# Altium project GYT_Rx.PrjPcb
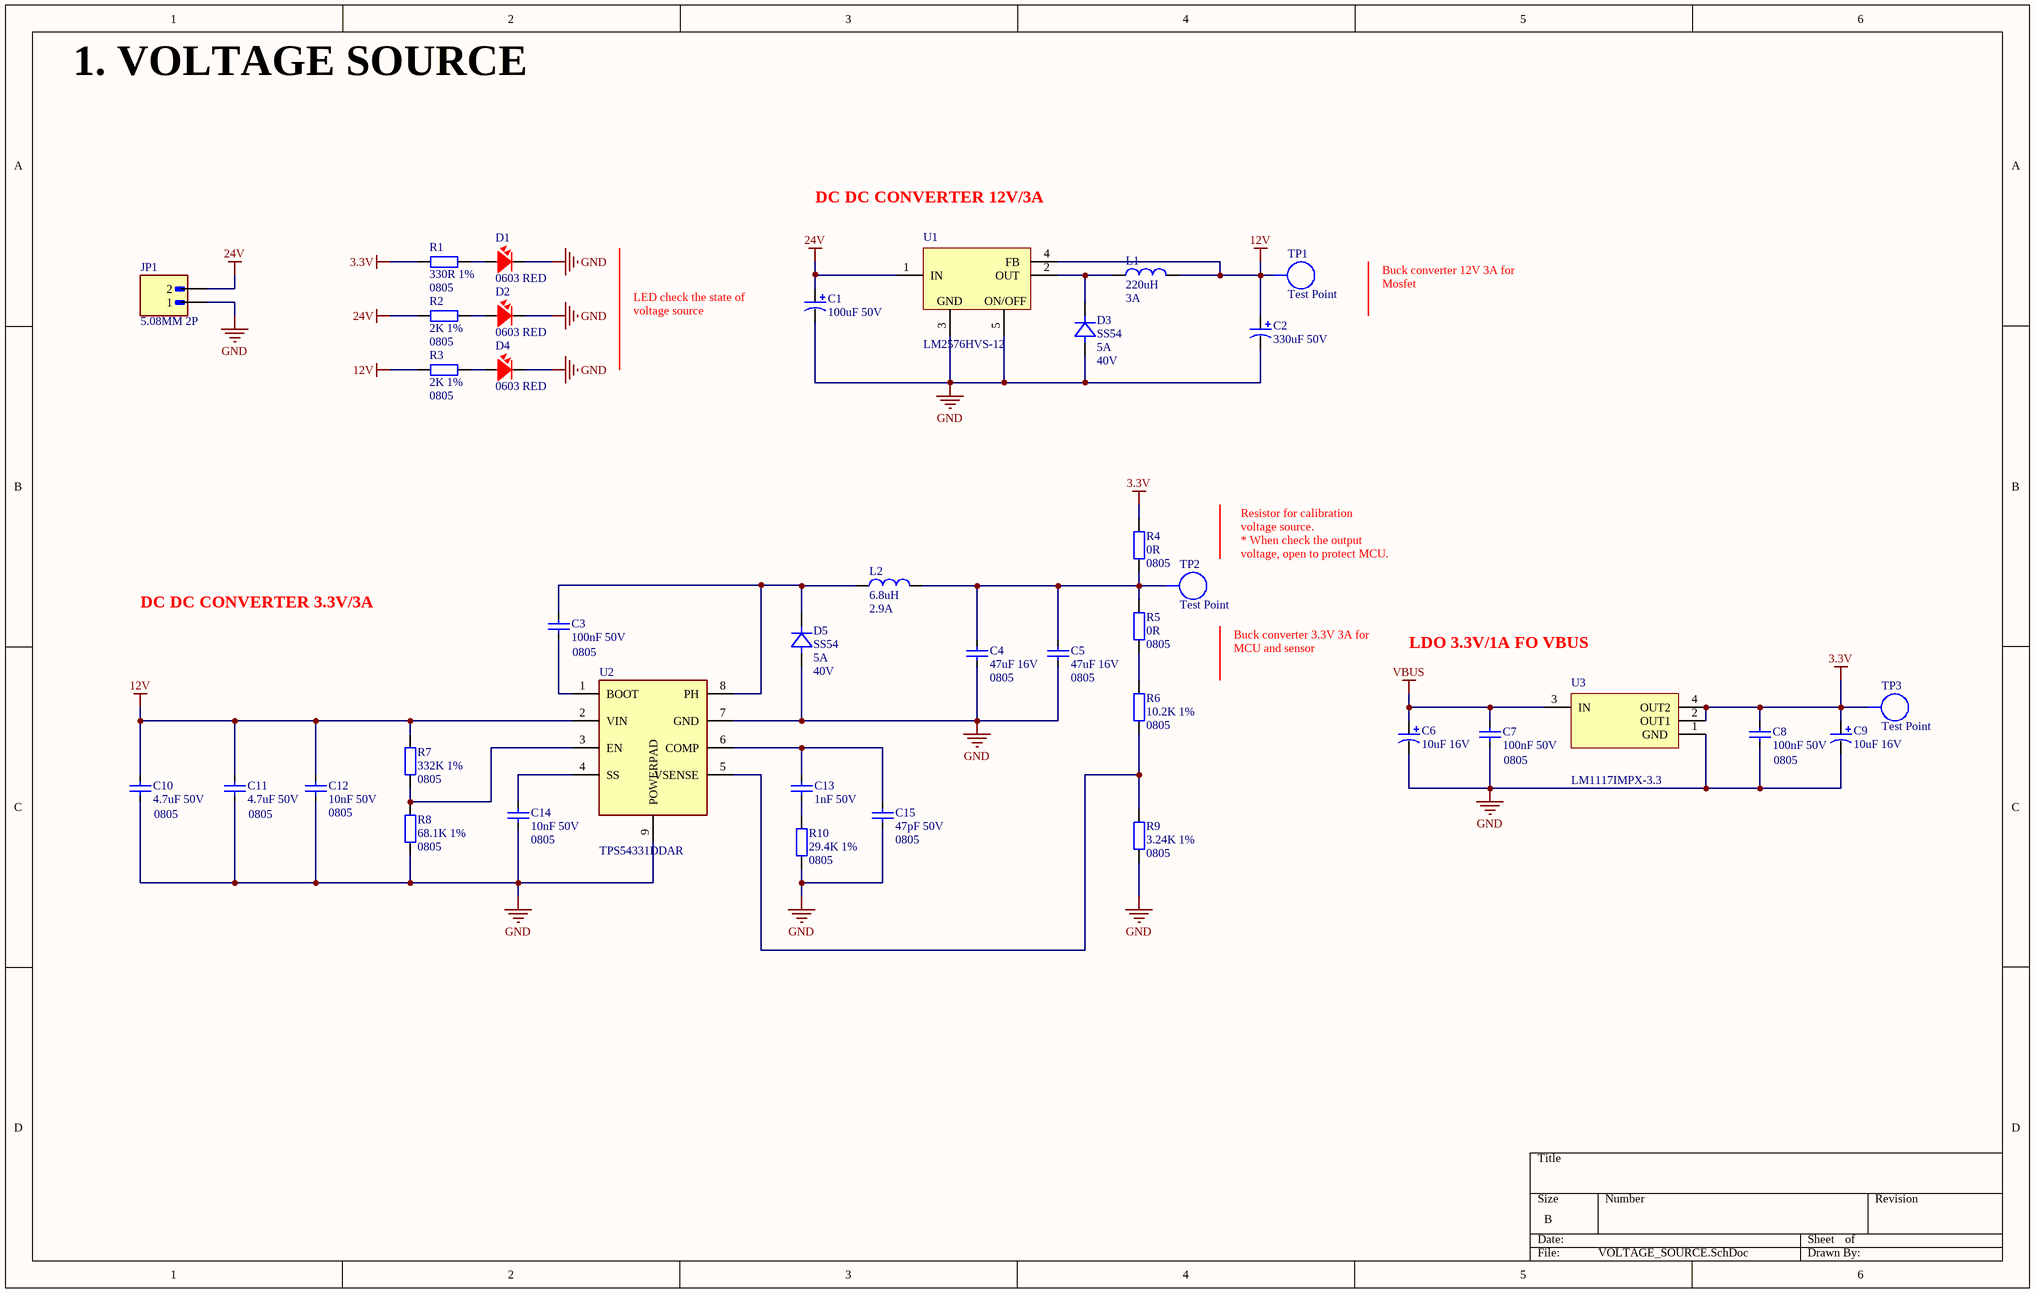
[diagram p0: VOLTAGE_SOURCE.SchDoc]
4 sheets, 111 parts. Net scope: global (net labels, ports and power ports of the same name join across sheets).
Board file: PCB.PcbDoc
Sheets:
  VOLTAGE_SOURCE.SchDoc
  MCU.SchDoc
  SENSOR.SchDoc
  H_BRIDGE.SchDoc

## Sheet VOLTAGE_SOURCE.SchDoc: Voltage Source
size B; ApprovedBy: Nhatkhongbuon; Author: Nhatkhongbuon; Organization: Tecotec; Address1: CT3ABlock Me Tri Thuong; Address2: Urban Zone; SheetNumber: 1; SheetTotal: 4; ProjectTitle: Tecotec_GYT_Rx

### Parts
C1  100uF 50V  [CAP-ALU-SMD-F-NEW]
C2  330uF 50V  [CAP-ALU-SMD-G-NEW]
C3  100nF 50V  Size: 0805  [CAP_SMD_0805_NEW]
C4  47uF 16V  Size: 0805  [CAP_SMD_0805_NEW]
C5  47uF 16V  Size: 0805  [CAP_SMD_0805_NEW]
C6  10uF 16V  [CAP-ALU-SMD-B -NEW]
C7  100nF 50V  Size: 0805  [CAP_SMD_0805_NEW]
C8  100nF 50V  Size: 0805  [CAP_SMD_0805_NEW]
C9  10uF 16V  [CAP-ALU-SMD-B -NEW]
C10  4.7uF 50V  Size: 0805  [CAP_SMD_0805_NEW]
C11  4.7uF 50V  Size: 0805  [CAP_SMD_0805_NEW]
C12  10nF 50V  Size: 0805  [CAP_SMD_0805_NEW]
C13  1nF 50V  [CAP_SMD_0805_NEW]
C14  10nF 50V  Size: 0805  [CAP_SMD_0805_NEW]
C15  47pF 50V  Size: 0805  [CAP_SMD_0805_NEW]
D1  0603 RED  [LED-0603]
D2  0603 RED  [LED-0603]
D3  SS54  Current: 5A  DC Voltage: 40V  [SMA]
D4  0603 RED  [LED-0603]
D5  SS54  Current: 5A  DC Voltage: 40V  [SMA]
JP1  5.08MM 2P  [5.08MM 2P]
L1  Inductor: 220uH  Current: 3A  [L_TOR_13x7]  (hidden comment: 220uH 3A)
L2  Inductor: 6.8uH  Current: 2.9A  [CD74R]  (hidden comment: CD74R_6.8uH)
R1  330R 1%  Size: 0805  [RES_SMD_0805]
R2  2K 1%  Size: 0805  [RES_SMD_0805]
R3  2K 1%  Size: 0805  [RES_SMD_0805]
R4  0R  Size: 0805  [RES_SMD_0805]
R5  0R  Size: 0805  [RES_SMD_0805]
R6  10.2K 1%  Size: 0805  [RES_SMD_0805]
R7  332K 1%  Size: 0805  [RES_SMD_0805]
R8  68.1K 1%  Size: 0805  [RES_SMD_0805]
R9  3.24K 1%  Size: 0805  [RES_SMD_0805]
R10  29.4K 1%  Size: 0805  [RES_SMD_0805]
TP1  Test Point  [TEST_POINT]
TP2  Test Point  [TEST_POINT]
TP3  Test Point  [TEST_POINT]
U1  LM2576HVS-12  [IC_LM2596SX-12/NOPB]
U2  TPS54331DDAR  [TPS54531DDAR]
U3  LM1117IMPX-3.3  [SOT-223-4]

### Nets
3.3V: C8.2 C9.1 R1.1 R4.2 TP3.1 U3.2(OUT1) U3.4(OUT2)
12V: C2.1 C10.2 C11.2 C12.2 L1.2 R3.2 R7.2 TP1.1 U1.4(FB) U2.2(VIN)
24V: C1.1 JP1.2 R2.2 U1.1(IN)
GND: C1.2 C2.2 C4.1 C5.1 C6.2 C7.1 C8.1 C9.2 C10.1 C11.1 C12.1 C14.1 C15.1 D1.2 D2.2 D3.A D4.2 D5.A JP1.1 R8.1 R9.1 R10.1 U1.3(GND) U1.5(ON/OFF) U2.7(GND) U2.9(POWERPAD) U3.1(GND)
VBUS: C6.1 C7.2 U3.3(IN)
NetC3_1: C3.1 U2.1(BOOT)
NetC3_2: C3.2 D5.C L2.1 U2.8(PH)
NetC4_2: C4.2 C5.2 L2.2 R4.1 R5.2 TP2.1
NetC13_1: C13.1 R10.2
NetC13_2: C13.2 C15.2 U2.6(COMP)
NetC14_2: C14.2 U2.4(SS)
NetD1_1: D1.1 R1.2
NetD2_1: D2.1 R2.1
NetD3_C: D3.C L1.1 U1.2(OUT)
NetD4_1: D4.1 R3.1
NetR5_1: R5.1 R6.2
NetR6_1: R6.1 R9.2 U2.5(VSENSE)
NetR7_1: R7.1 R8.2 U2.3(EN)

### Notes on the sheet
- 1. VOLTAGE SOURCE
- DC DC CONVERTER 12V/3A
- (near C1) LED check the state of voltage source
- Buck converter 12V 3A for Mosfet
- DC DC CONVERTER 3.3V/3A
- Resistor for calibration voltage source.
  * When check the output voltage, open to protect MCU.
- Buck converter 3.3V 3A for MCU and sensor
- LDO 3.3V/1A FO VBUS
- Author:
- Title:
- Size:
- A4
- Project:
- Approved:
- Revision:
- Modified Date:
- CONFIDENTIAL
- Date:
- SW Version:
- (in symbol LM1117IMPX-3.3/NOPB) /
- (in symbol LM2576HVS-12) /

### Library data of the parts
C1 = C_ALU_100uF_50V_F: 100uF 50V 140mA@120Hz ±20% SMD,D8xL10mm Aluminum Electrolytic Capacitors - SMD ROHS; Manufacturer: Nichicon; Manufacture Part Number: UWT1H101MNL1GS; Link: https://jlcpcb.com/partdetail/Nichicon-UWT1H101MNL1GS/C445063?spm=searchList; Price: $0.1311
C2 = C_ALU_330uF_50V_G: 330uF 50V 170mA@120Hz ±20% SMD,D10xL10.2mm Aluminum Electrolytic Capacitors - SMD ROHS; Manufacturer: KNSCHA; Manufacture Part Number: RVT330UF50V167RV085; Packaging: Cut Tape (CT); Link: https://jlcpcb.com/partdetail/KNSCHA-RVT330UF50V167RV085/C5155333; Price: $0.0941
C3 C7 C8 = C0805_MLCC_100nF_50V: 0.1 µF ±10% 50V Ceramic Capacitor X7R 0805 (2012 Metric); Manufacturer: YAGEO; Manufacture Part Number: CC0805KRX7R9BB104; Packaging: Cut Tape (CT); Link: https://www.digikey.cn/en/products/detail/yageo/CC0805KRX7R9BB104/302874; Price: $0.10
C4 C5 = C0805_MLCC_47uF_16V: 47 µF ±10% 16V Ceramic Capacitor X5R 1210 (3225 Metric); Manufacturer: Samsung Electro-Mechanics; Manufacture Part Number: CL32A476KOJNNNE; Packaging: Cut Tape (CT); Link: https://www.digikey.cn/en/products/detail/samsung-electro-mechanics/CL32A476KOJNNNE/3889034; Price: $0.51
C6 C9 = C_ALU_10uF_16V_B: 10uF 16V 14mA@120Hz ±20% SMD,D4xL5.4mm Aluminum Electrolytic Capacitors - SMD ROHS; Manufacturer: KNSCHA; Manufacture Part Number: RST10UF16V013; Packaging: Cut Tape (CT); Link: https://www.lcsc.com/product-detail/Aluminum-Electrolytic-Capacitors-SMD_KNSCHA-RST10UF16V013_C4747968.html; Price: $0.0217; Size: B
C10 C11 = C0805_MLCC_4.7uF_50V: 4.7 µF ±10% 50V Ceramic Capacitor X5R 0805 (2012 Metric); Manufacturer: Samsung Electro-Mechanics; Manufacture Part Number: CL21A475KBQNNNE; Packaging: Cut Tape (CT); Link: https://www.digikey.cn/en/products/detail/samsung-electro-mechanics/CL21A475KBQNNNE/3886906; Price: $0.23
C12 C14 = C0805_MLCC_10nF_50V: 10000 pF ±10% 50V Ceramic Capacitor X7R 0805 (2012 Metric); Manufacturer: Samsung Electro-Mechanics; Manufacture Part Number: CL21B103KBANNNC; Packaging: Cut Tape (CT); Link: https://www.digikey.cn/en/products/detail/samsung-electro-mechanics/CL21B103KBANNNC/3886673; Price: $0.10
C13 = C0805_MLCC_1nF_50V: 1000 pF ±5% 50V Ceramic Capacitor C0G, NP0 0805 (2012 Metric); Manufacturer: KEMET; Manufacture Part Number: C0805C102J5GAC7800; Packaging: Cut Tape (CT); Link: https://www.digikey.cn/en/products/detail/kemet/C0805C102J5GAC7800/411135; Price: $0.11; Size: 0805
C15 = C0805_MLCC_47pF_50V: 47 pF ±5% 50V Ceramic Capacitor C0G, NP0 0805 (2012 Metric); Manufacturer: YAGEO; Manufacture Part Number: CC0805JRNPO9BN470; Packaging: Cut Tape (CT); Link: https://www.digikey.cn/en/products/detail/yageo/CC0805JRNPO9BN470/302841; Price: $0.10
D1 D2 D4 = LED_0603_RED: Red 625nm LED Indication - Discrete 2V 0603 (1608 Metric); Manufacturer: Würth Elektronik; Manufacture Part Number: 150060RS75000; Packaging: Cut Tape (CT); Link: https://www.digikey.cn/en/products/detail/w%C3%BCrth-elektronik/150060RS75000/4489901; Price: $0.15
D3 D5 = SS54: DIODE SCHOTTKY 40V 5A SMA; Manufacturer: EVVO; Manufacture Part Number: SS54; Packaging: Cut Tape (CT); Link: https://www.digikey.cn/en/products/detail/evvo/SS54/21407219; Price: $0.73
JP1 = TERMINAL_5.08MM_2P: 2 Position Terminal Block Header, Male Pins, Shrouded (2 Side) 0.200" (5.08mm) 90°, Right Angle Through Hole; Manufacturer: Phoenix Contact; Manufacture Part Number: 1759017; Packaging: Bulk; Link: https://www.digikey.cn/en/products/detail/phoenix-contact/1759017/260463?s=N4IgTCBcDaIIwHYCsBOADIkBdAvkA; Price: $0.58
L1 = L_220uH_3A_LM2576: Link: https://banlinhkien.com/cuon-cam-220uh-3a-lm2576-p6646202.html
L2 = CD74R_6.8uH: 2.9A 6.8uH ±30% SMD,7.5x7.5mm Power Inductors ROHS; Manufacturer: SHOU HAN; Manufacture Part Number: CYH74-6.8UH; Link: https://www.lcsc.com/product-detail/Power-Inductors_SHOU-HAN-CYH74-6-8UH_C19268626.html; Price: $ 0.0674
R1 = R0805_330R: 330 Ohms ±1% 0.125W, 1/8W Chip Resistor 0805 (2012 Metric) Automotive AEC-Q200 Thick Film; Manufacturer: Stackpole Electronics Inc; Manufacture Part Number: RMCF0805FT330R; Packaging: Cut Tape (CT); Link: https://www.digikey.cn/en/products/detail/stackpole-electronics-inc/RMCF0805FT330R/1760484; Price: $0.10
R2 R3 = R0805_2K: 2 kOhms ±1% 0.125W, 1/8W Chip Resistor 0805 (2012 Metric) Automotive AEC-Q200 Thick Film; Manufacturer: Panasonic Electronic Components; Manufacture Part Number: ERJ-6ENF2001V; Packaging: Cut Tape (CT); Link: https://www.digikey.com/en/products/detail/panasonic-electronic-components/ERJ-6ENF2001V/111341; Price: $0.10
R4 R5 = R0805_0R: 0 Ohms Jumper Chip Resistor 0805 (2012 Metric) Automotive AEC-Q200 Thick Film; Manufacturer: Vishay Dale; Manufacture Part Number: CRCW08050000Z0EA; Packaging: Cut Tape (CT); Link: https://www.digikey.cn/en/products/detail/vishay-dale/CRCW08050000Z0EA/1175125; Price: $0.10
R6 = R0805_10.2K: 10.2 kOhms ±1% 0.125W, 1/8W Chip Resistor 0805 (2012 Metric) Moisture Resistant Thick Film; Manufacturer: YAGEO; Manufacture Part Number: RC0805FR-0710K2L; Packaging: Cut Tape (CT); Link: https://www.digikey.cn/en/products/detail/yageo/RC0805FR-0710K2L/727538; Price: $0.10
R7 = R0805_332K: 332 kOhms ±1% 0.125W, 1/8W Chip Resistor 0805 (2012 Metric) Moisture Resistant Thick Film; Manufacturer: YAGEO; Manufacture Part Number: RC0805FR-07332KL; Packaging: Cut Tape (CT); Price: $0.10; Link: https://www.digikey.cn/en/products/detail/yageo/RC0805FR-07332KL/727869
R8 = R0805_68.1K: 68.1 kOhms ±1% 0.125W, 1/8W Chip Resistor 0805 (2012 Metric) Moisture Resistant Thick Film; Manufacturer: YAGEO; Manufacture Part Number: RC0805FR-0768K1L; Packaging: Cut Tape (CT); Price: $0.10; Link: https://www.digikey.cn/en/products/detail/yageo/RC0805FR-0768K1L/728100?s=N4IgTCBcDaIEoGEAMAOJBWAYnAtEg7AGwoDSAjADIgC6AvkA
R9 = R0805_3.24K: 3.24 kOhms ±1% 0.125W, 1/8W Chip Resistor 0805 (2012 Metric) Moisture Resistant Thick Film; Manufacturer: YAGEO; Manufacture Part Number: RC0805FR-073K24L; Packaging: Cut Tape (CT); Link: https://www.digikey.cn/en/products/detail/yageo/RC0805FR-073K24L/727811; Price: $0.10
R10 = R0805_29.4K: 29.4 kOhms ±1% 0.125W, 1/8W Chip Resistor 0805 (2012 Metric) Moisture Resistant Thick Film; Manufacturer: YAGEO; Manufacture Part Number: RC0805FR-0729K4L; Packaging: Cut Tape (CT); Price: $0.10; Link: https://www.digikey.cn/en/products/detail/yageo/RC0805FR-0729K4L/727796
TP1-TP3 = TEST_POINT
U1 = LM2576HVS-12: Switching Voltage Regulators SIMPLE SWITCHER&reg; 4V to 60V, 3A Low Component Count Step-Down Regulator 5-DDPAK/TO-263 -40 to 125; Manufacturer: Texas Instruments; Manufacture Part Number: LM2576HVS-12; Packaging: Tube; Link: https://www.mouser.vn/ProductDetail/Texas-Instruments/LM2576HVS-12?qs=X1J7HmVL2ZG26yVYlinkCQ%3D%3D; Price: $11.83
U2 = TPS54331DDAR: Buck Switching Regulator IC Positive Adjustable 0.8V 1 Output 3A 8-PowerSOIC (0.154", 3.90mm Width); Manufacturer: Texas Instruments; Manufacture Part Number: TPS54331DDAR; Packaging: Cut Tape; Link: https://www.digikey.cn/en/products/detail/texas-instruments/TPS54331DDAR/3053257; Price: $1.88
U3 = LM1117IMPX-3.3/NOPB: Linear Voltage Regulator IC Positive Fixed 1 Output 800mA SOT-223-4; Manufacturer: Texas Instruments; Manufacture Part Number: LM1117IMPX-3.3/NOPB; Packaging: Cut Tape (CT); Link: https://www.digikey.cn/en/products/detail/texas-instruments/LM1117IMPX-3-3-NOPB/1870906; Price: $1.14

## Sheet MCU.SchDoc
size A4; SheetNumber: 2; SheetTotal: 4
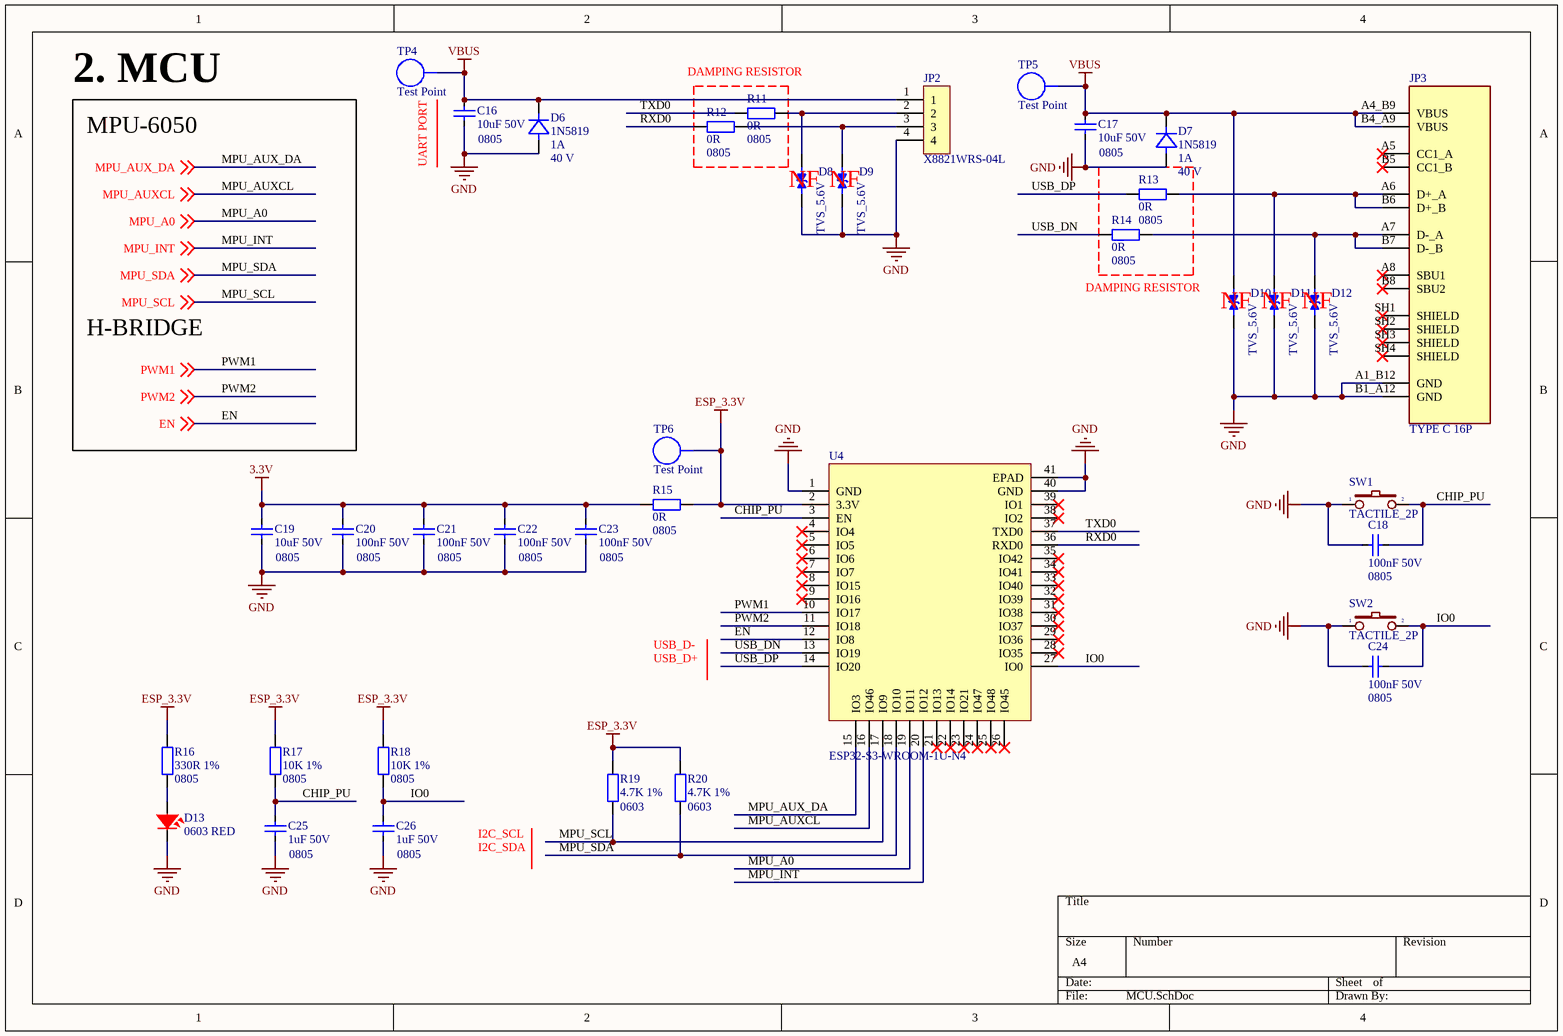
[diagram p1: MCU.SchDoc]

### Parts
C16  10uF 50V  Size: 0805  [CAP_SMD_0805_NEW]
C17  10uF 50V  Size: 0805  [CAP_SMD_0805_NEW]
C18  100nF 50V  Size: 0805  [CAP_SMD_0805_NEW]
C19  10uF 50V  Size: 0805  [CAP_SMD_0805_NEW]
C20  100nF 50V  Size: 0805  [CAP_SMD_0805_NEW]
C21  100nF 50V  Size: 0805  [CAP_SMD_0805_NEW]
C22  100nF 50V  Size: 0805  [CAP_SMD_0805_NEW]
C23  100nF 50V  Size: 0805  [CAP_SMD_0805_NEW]
C24  100nF 50V  Size: 0805  [CAP_SMD_0805_NEW]
C25  1uF 50V  Size: 0805  [CAP_SMD_0805_NEW]
C26  1uF 50V  Size: 0805  [CAP_SMD_0805_NEW]
D6  1N5819  Current - Average Rectified (Io): 1A  Voltage - DC Reverse (Vr) (Max): 40 V  [DIO-SMD-123]
D7  1N5819  Current - Average Rectified (Io): 1A  Voltage - DC Reverse (Vr) (Max): 40 V  [DIO-SMD-123]
D8  TVS_5.6V  [SOD_523]
D9  TVS_5.6V  [SOD_523]
D10  TVS_5.6V  [SOD_523]
D11  TVS_5.6V  [SOD_523]
D12  TVS_5.6V  [SOD_523]
D13  0603 RED  [LED-0603]
JP2  X8821WRS-04L  [CONN_X8821WRS-04L-LPSN]
JP3  TYPE C 16P  [TYPE C 16P]
R11  0R  Size: 0805  [RES_SMD_0805]
R12  0R  Size: 0805  [RES_SMD_0805]
R13  0R  Size: 0805  [RES_SMD_0805]
R14  0R  Size: 0805  [RES_SMD_0805]
R15  0R  Size: 0805  [RES_SMD_0805]
R16  330R 1%  Size: 0805  [RES_SMD_0805]
R17  10K 1%  Size: 0805  [RES_SMD_0805]
R18  10K 1%  Size: 0805  [RES_SMD_0805]
R19  4.7K 1%  Size: 0603  [RES_SMD_0603]
R20  4.7K 1%  Size: 0603  [RES_SMD_0603]
SW1  TACTILE_2P  [C&K SW 2P]
SW2  TACTILE_2P  [C&K SW 2P]
TP4  Test Point  [TEST_POINT]
TP5  Test Point  [TEST_POINT]
TP6  Test Point  [TEST_POINT]
U4  ESP32-S3-WROOM-1U-N4  [ESP32-S3-WROOM-1U]

### Nets
3.3V: C19.2 C20.2 C21.2 C22.2 C23.2 R15.2
ESP_3.3V: R15.1 R16.2 R17.2 R18.2 R19.2 R20.2 TP6.1 U4.2(3.3V)
GND: C16.1 C17.1 C18.2 C19.1 C20.1 C21.1 C22.1 C23.1 C24.2 C25.1 C26.1 D6.A D7.A D8.1 D9.1 D10.1 D11.1 D12.1 D13.2 JP2.4 JP3.A1_B12(GND) JP3.B1_A12(GND) SW1.1 SW2.1 U4.1(GND) U4.40(GND) U4.41(EPAD)
VBUS: C16.2 C17.2 D6.C D7.C D10.2 JP2.1 JP3.A4_B9(VBUS) JP3.B4_A9(VBUS) TP4.1 TP5.1
CHIP_PU: C18.1 C25.2 R17.1 SW1.2 U4.3(EN)
EN: U4.12(IO8) ; off-sheet EN
IO0: C24.1 C26.2 R18.1 SW2.2 U4.27(IO0)
MPU_A0: U4.19(IO11) ; off-sheet MPU_A0
MPU_AUX_DA: U4.15(IO3) ; off-sheet MPU_AUX_DA
MPU_AUXCL: U4.16(IO46) ; off-sheet MPU_AUXCL
MPU_INT: U4.20(IO12) ; off-sheet MPU_INT
MPU_SCL: R19.1 U4.17(IO9) ; off-sheet MPU_SCL
MPU_SDA: R20.1 U4.18(IO10) ; off-sheet MPU_SDA
PWM1: U4.10(IO17) ; off-sheet PWM1
PWM2: U4.11(IO18) ; off-sheet PWM2
RXD0: R12.2 U4.36(RXD0)
TXD0: R11.2 U4.37(TXD0)
USB_DN: R14.2 U4.13(IO19)
USB_DP: R13.2 U4.14(IO20)
NetD8_2: D8.2 JP2.2 R11.1
NetD9_2: D9.2 JP2.3 R12.1
NetD11_2: D11.2 JP3.A6(D+_A) JP3.B6(D+_B) R13.1
NetD12_2: D12.2 JP3.A7(D-_A) JP3.B7(D-_B) R14.1
NetD13_1: D13.1 R16.1

Not connected (* = marked no-connect by the designer): JP3 A5(CC1_A)* A8(SBU1)* B5(CC1_B)* B8(SBU2)* SH1(SHIELD)* SH2(SHIELD)* SH3(SHIELD)* SH4(SHIELD)*; U4 4(IO4)* 5(IO5)* 6(IO6)* 7(IO7)* 8(IO15)* 9(IO16)* 21(IO13)* 22(IO14)* 23(IO21)* 24(IO47)* 25(IO48)* 26(IO45)* 28(IO35)* 29(IO36)* 30(IO37)* 31(IO38)* 32(IO39)* 33(IO40)* 34(IO41)* 35(IO42)* 38(IO2)* 39(IO1)*

### Notes on the sheet
- 2. MCU
- DAMPING RESISTOR
- MPU-6050
- UART PORT
- (near D8) NF
- (near D9) NF
- (near D10) NF
- (near D11) NF
- (near D12) NF
- H-BRIDGE
- USB_D-
- USB_D+
- I2C_SCL
- I2C_SDA

### Library data of the parts
C16 C17 C19 = C0805_MLCC_10uF_50V: 10 µF ±20% 50V Ceramic Capacitor X5R 0805 (2012 Metric); Manufacturer: Murata Electronics; Manufacture Part Number: GRM21BR61H106ME43L; Packaging: Cut Tape (CT); Link: https://www.digikey.cn/en/products/detail/murata-electronics/GRM21BR61H106ME43L/10326317; Price: $0.34
C18 C20-C24 = C0805_MLCC_100nF_50V: as C3 on sheet VOLTAGE_SOURCE; Packaging: Cut Tape (CT); Link: https://www.digikey.cn/en/products/detail/yageo/CC0805KRX7R9BB104/302874; Price: $0.10
C25 C26 = C0805_MLCC_1uF_50V: 1 µF ±10% 50V Ceramic Capacitor X7R 0805 (2012 Metric); Manufacturer: Samsung Electro-Mechanics; Manufacture Part Number: CL21B105KBFNNNG; Packaging: Cut Tape (CT); Link: https://www.digikey.cn/en/products/detail/samsung-electro-mechanics/CL21B105KBFNNNG/3894467; Price: $0.11
D6 D7 = 1N5819: Diode 40 V 1A Surface Mount SOD-123; Manufacturer: Diodes Incorporated; Manufacture Part Number: 1N5819HW-7-F; Voltage - Forward (Vf) (Max) @ If: 450 mV @ 1 A; Capacitance @ Vr, F: 60pF @ 4V, 1MHz; Packaging: Cut Tape (CT); Link: https://www.digikey.cn/en/products/detail/diodes-incorporated/1N5819HW-7-F/814970; Price: $0.43; Operating Temperature - Junction: -65°C ~ 125°C
D8-D12 = TVS_5.6V: 9.4A 18.6V 5.6V Bi-Directional 5V SOD-523 Electrostatic and Surge Protection (TVS/ESD) ROHS; Manufacturer: LRC; Manufacture Part Number: LESD5D5.0CT1G; Voltage - Reverse Standoff (Typ): 4V; Voltage - Breakdown (Min): 6V; Voltage - Clamping (Max) @ Ipp: 8V; Packaging: Cut Tape (CT); Link: https://www.lcsc.com/product-detail/New-Arrivals_Leshan-Radio-LESD5D5-0CT1G_C383211.html; Price: $ 0.0149
D13 = LED_0603_RED: as D1 on sheet VOLTAGE_SOURCE; Packaging: Cut Tape (CT); Link: https://www.digikey.cn/en/products/detail/w%C3%BCrth-elektronik/150060RS75000/4489901; Price: $0.15
JP2 = X8821WRS-04L: 1x4P 4P XH 1 Tin 2.5mm 4 3A Brass Surface Mount，Right Angle SMD,P=2.5mm,Surface Mount，Right Angle Wire To Board Connector ROHS; Manufacturer: XKB Connection; Manufacture Part Number: X8821WRS-04-9TSN; Link: https://www.lcsc.com/product-detail/Wire-To-Board-Connector_XKB-Connection-X8821WRS-04-9TSN_C397434.html; Price: $ 0.1564
JP3 = TYPE_C_16P: USB-C (USB TYPE-C) USB 2.0 Receptacle Connector 24 (16+8 Dummy) Position Surface Mount, Right Angle; Through Hole; Manufacturer: Amphenol ICC (Commercial Products); Manufacture Part Number: 12402012E212A; Packaging: Cut Tape; Link: https://www.digikey.cn/en/products/detail/amphenol-cs-commercial-products/12402012E212A/13683192; Price: $0.79
R11-R15 = R0805_0R: as R4 on sheet VOLTAGE_SOURCE; Packaging: Cut Tape (CT); Link: https://www.digikey.cn/en/products/detail/vishay-dale/CRCW08050000Z0EA/1175125; Price: $0.10
R16 = R0805_330R: as R1 on sheet VOLTAGE_SOURCE; Packaging: Cut Tape (CT); Link: https://www.digikey.cn/en/products/detail/stackpole-electronics-inc/RMCF0805FT330R/1760484; Price: $0.10
R17 R18 = R0805_10K: 10 kOhms ±1% 0.125W, 1/8W Chip Resistor 0805 (2012 Metric) Moisture Resistant Thick Film; Manufacturer: YAGEO; Manufacture Part Number: RC0805FR-0710KL; Packaging: Cut Tape (CT); Price: $0.10; Link: https://www.digikey.cn/en/products/detail/yageo/RC0805FR-0710KL/727535
R19 R20 = R0603_4.7K: 4.7 kOhms ±1% 0.1W, 1/10W Chip Resistor 0603 (1608 Metric) Moisture Resistant Thick Film; Manufacturer: YAGEO; Manufacture Part Number: RC0603FR-074K7L; Packaging: Cut Tape (CT); Link: https://www.digikey.com/en/products/detail/yageo/RC0603FR-074K7L/727212; Price: $0.10
SW1 SW2 = SWITCH_TACTILE_SPST: Tactile Switch SPST-NO Top Actuated Surface Mount; Manufacturer: C&K; Manufacture Part Number: PTS636 SM25F SMTR LFS; Packaging: Cut Tape (CT); Link: https://www.digikey.cn/en/products/detail/c-k/PTS636-SM25F-SMTR-LFS/10071742?s=N4IgTCBcDaIAoBUDKA2AzCgBEgsmArAGLY4IBKmAMoUiALoC%2BQA; Price: $0.24
TP4-TP6 = TEST_POINT
U4 = ESP32-S3-WROOM-1U-N4: SMD,18x19.2mm WiFi Modules ROHS; Manufacturer: Espressif Systems; Manufacture Part Number: ESP32-S3-WROOM-1U-N4; Packaging: Cut Tape (CT); Link: https://www.lcsc.com/product-detail/WiFi-Modules_Espressif-Systems-ESP32-S3-WROOM-1U-N4_C2980296.html; Price: $ 3.72

## Sheet SENSOR.SchDoc
size A4; SheetNumber: 3; SheetTotal: 4
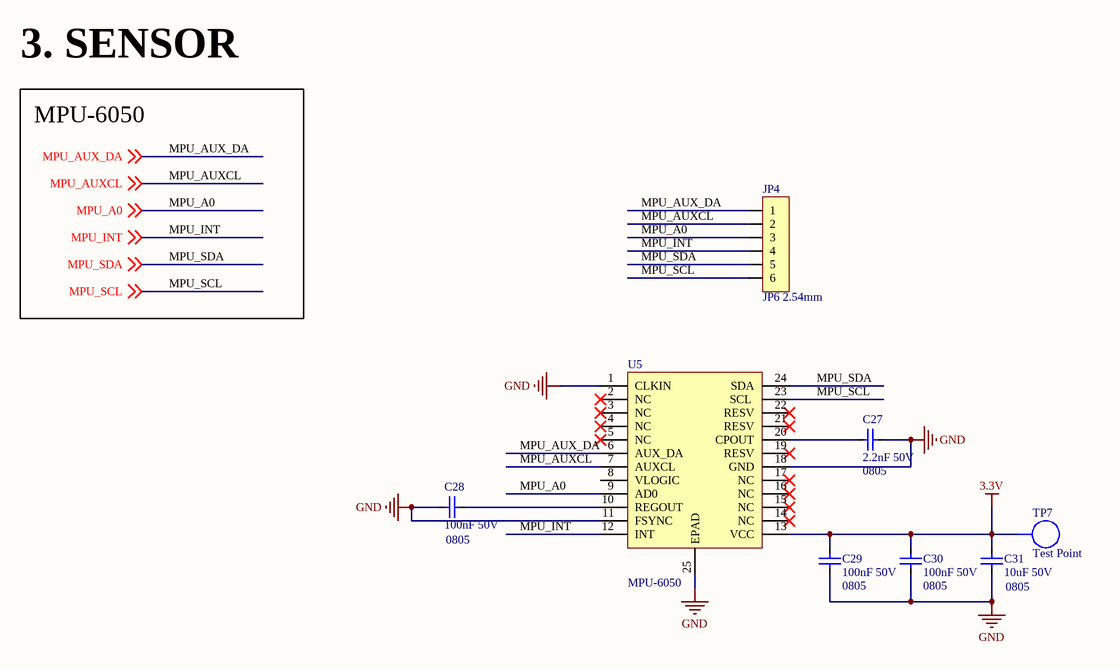
[diagram p2: SENSOR.SchDoc]

### Parts
C27  2.2nF 50V  Size: 0805  [CAP_SMD_0805_NEW]
C28  100nF 50V  Size: 0805  [CAP_SMD_0805_NEW]
C29  100nF 50V  Size: 0805  [CAP_SMD_0805_NEW]
C30  100nF 50V  Size: 0805  [CAP_SMD_0805_NEW]
C31  10uF 50V  Size: 0805  [CAP_SMD_0805_NEW]
JP4  JP6 2.54mm  [JP6_M]
TP7  Test Point  [TEST_POINT]
U5  MPU-6050  [QFN_24]

### Nets
3.3V: C29.1 C30.1 C31.2 TP7.1 U5.13(VCC)
GND: C27.1 C28.2 C29.2 C30.2 C31.1 U5.1(CLKIN) U5.11(FSYNC) U5.18(GND) U5.25(EPAD)
MPU_A0: JP4.3 U5.9(AD0) ; off-sheet MPU_A0
MPU_AUX_DA: JP4.1 U5.6(AUX_DA) ; off-sheet MPU_AUX_DA
MPU_AUXCL: JP4.2 U5.7(AUXCL) ; off-sheet MPU_AUXCL
MPU_INT: JP4.4 U5.12(INT) ; off-sheet MPU_INT
MPU_SCL: JP4.6 U5.23(SCL) ; off-sheet MPU_SCL
MPU_SDA: JP4.5 U5.24(SDA) ; off-sheet MPU_SDA
NetC27_2: C27.2 U5.20(CPOUT)
NetC28_1: C28.1 U5.10(REGOUT)

Not connected (* = marked no-connect by the designer): U5 2(NC)* 3(NC)* 4(NC)* 5(NC)* 8(VLOGIC) 14(NC)* 15(NC)* 16(NC)* 17(NC)* 19(RESV)* 21(RESV)* 22(RESV)*

### Notes on the sheet
- 3. SENSOR
- MPU-6050

### Library data of the parts
C27 = C0805_MLCC_2.2nF_50V: 2200 pF ±1% 50V Ceramic Capacitor C0G, NP0 0805 (2012 Metric); Manufacturer: YAGEO; Manufacture Part Number: CC0805FKNPO9BN222; Packaging: Cut Tape (CT); Link: https://www.digikey.cn/en/products/detail/yageo/CC0805FKNPO9BN222/5883918; Price: $0.45
C28-C30 = C0805_MLCC_100nF_50V: as C3 on sheet VOLTAGE_SOURCE; Packaging: Cut Tape (CT); Link: https://www.digikey.cn/en/products/detail/yageo/CC0805KRX7R9BB104/302874; Price: $0.10
C31 = C0805_MLCC_10uF_50V: as C16 on sheet MCU; Packaging: Cut Tape (CT); Link: https://www.digikey.cn/en/products/detail/murata-electronics/GRM21BR61H106ME43L/10326317; Price: $0.34
JP4 = JP6M: Connector Header Through Hole 6 position 0.100" (2.54mm); Manufacturer: Würth Elektronik; Manufacture Part Number: 61300611121; Packaging: Bulk; Link: https://www.digikey.cn/en/products/detail/w%C3%BCrth-elektronik/61300611121/4846833; Price: $0.35
TP7 = TEST_POINT
U5 = MPU-6050: Accelerometer, Gyroscope, 6 Axis Sensor I2C Output; Manufacturer: TDK InvenSense; Manufacture Part Number: MPU-6050; Packaging: Cut Tape; Link: https://www.lcsc.com/product-detail/Attitude-Sensor-Gyroscope_TDK-InvenSense-MPU-6050_C24112.html; Price: $ 7.87

## Sheet H_BRIDGE.SchDoc
size A4; SheetNumber: 4; SheetTotal: 4
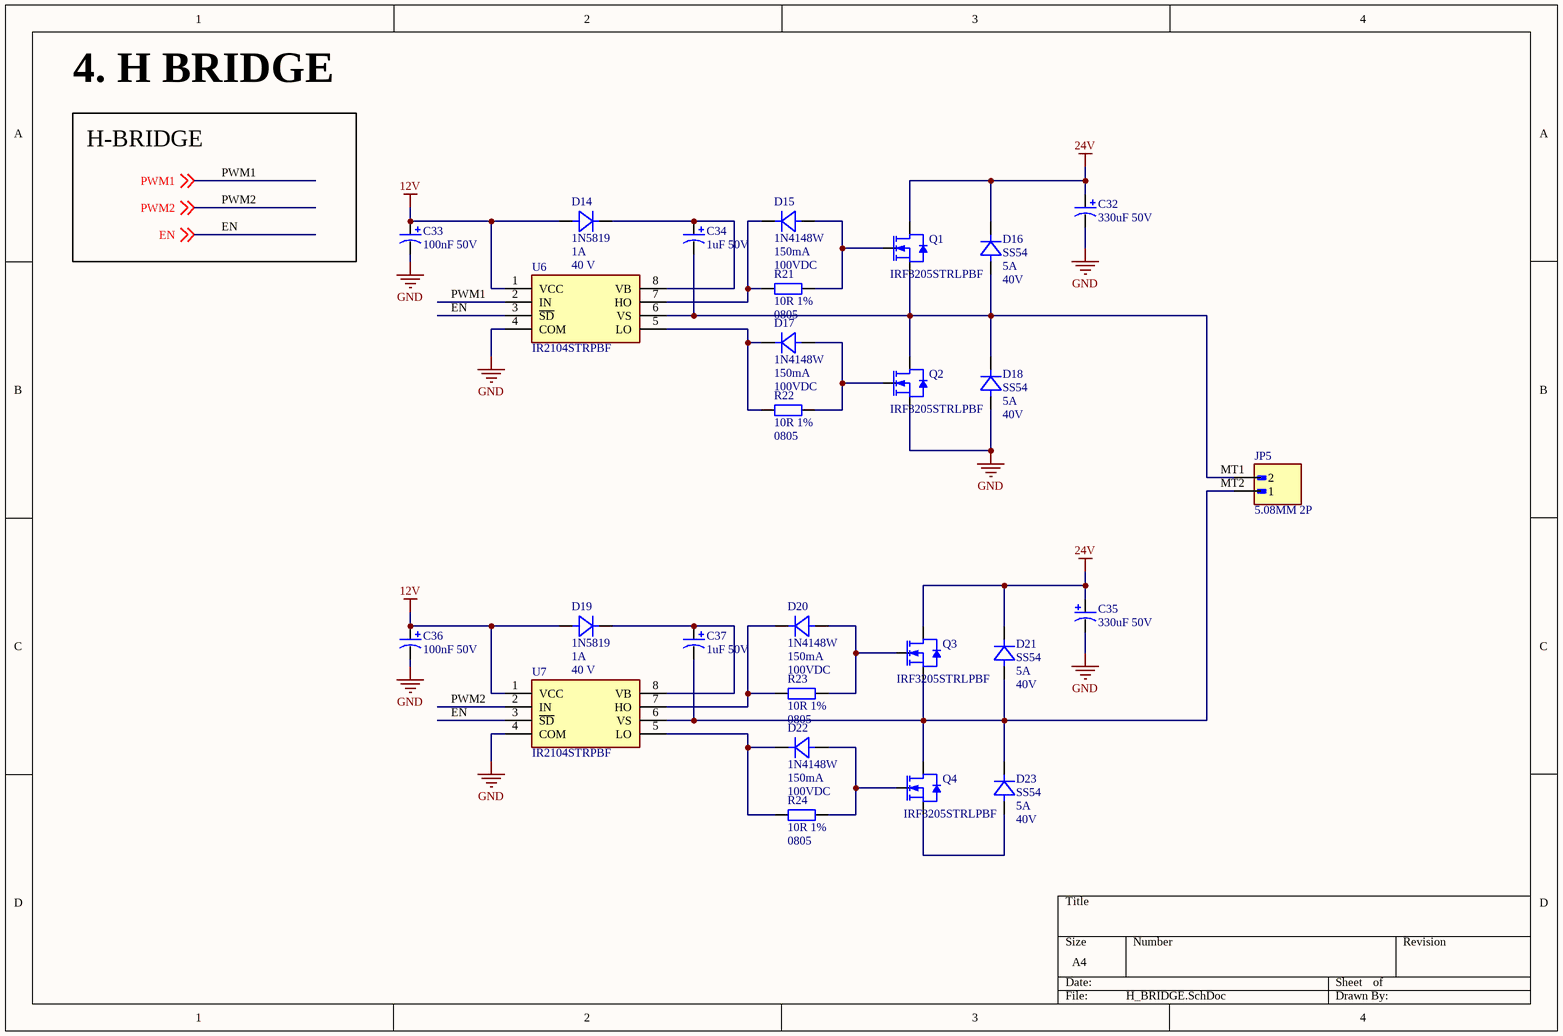
[diagram p3: H_BRIDGE.SchDoc]

### Parts
C32  330uF 50V  [CAP-ALU-SMD-G-NEW]
C33  100nF 50V  [CAP-ALU-SMD-B -NEW]
C34  1uF 50V  [CAP-ALU-SMD-B -NEW]
C35  330uF 50V  [CAP-ALU-SMD-G-NEW]
C36  100nF 50V  [CAP-ALU-SMD-B -NEW]
C37  1uF 50V  [CAP-ALU-SMD-B -NEW]
D14  1N5819  Current - Average Rectified (Io): 1A  Voltage - DC Reverse (Vr) (Max): 40 V  [DIO-SMD-123]
D15  1N4148W  Current: 150mA  DC Voltage: 100VDC  [DIO-SMD-123]
D16  SS54  Current: 5A  DC Voltage: 40V  [SMA]
D17  1N4148W  Current: 150mA  DC Voltage: 100VDC  [DIO-SMD-123]
D18  SS54  Current: 5A  DC Voltage: 40V  [SMA]
D19  1N5819  Current - Average Rectified (Io): 1A  Voltage - DC Reverse (Vr) (Max): 40 V  [DIO-SMD-123]
D20  1N4148W  Current: 150mA  DC Voltage: 100VDC  [DIO-SMD-123]
D21  SS54  Current: 5A  DC Voltage: 40V  [SMA]
D22  1N4148W  Current: 150mA  DC Voltage: 100VDC  [DIO-SMD-123]
D23  SS54  Current: 5A  DC Voltage: 40V  [SMA]
JP5  5.08MM 2P  [5.08MM 2P]
Q1  IRF3205STRLPBF  [TO263-3]
Q2  IRF3205STRLPBF  [TO263-3]
Q3  IRF3205STRLPBF  [TO263-3]
Q4  IRF3205STRLPBF  [TO263-3]
R21  10R 1%  Size: 0805  [RES_SMD_0805]
R22  10R 1%  Size: 0805  [RES_SMD_0805]
R23  10R 1%  Size: 0805  [RES_SMD_0805]
R24  10R 1%  Size: 0805  [RES_SMD_0805]
U6  IR2104STRPBF  [SOIC-8]
U7  IR2104STRPBF  [SOIC-8]

### Nets
12V: C33.1 C36.1 D14.A D19.A U6.1(VCC) U7.1(VCC)
24V: C32.1 C35.1 D16.C D21.C Q1.4(D) Q3.4(D)
GND: C32.2 C33.2 C35.2 C36.2 D18.A Q2.3(S) U6.4(COM) U7.4(COM)
EN: U6.3(~{SD}) U7.3(~{SD}) ; off-sheet EN
MT1: C34.2 D16.A D18.C JP5.2 Q1.3(S) Q2.4(D) U6.6(VS)
MT2: C37.2 D21.A D23.C JP5.1 Q3.3(S) Q4.4(D) U7.6(VS)
PWM1: U6.2(IN) ; off-sheet PWM1
PWM2: U7.2(IN) ; off-sheet PWM2
NetC34_1: C34.1 D14.C U6.8(VB)
NetC37_1: C37.1 D19.C U7.8(VB)
NetD15_A: D15.A Q1.1(G) R21.2
NetD15_C: D15.C R21.1 U6.7(HO)
NetD17_A: D17.A Q2.1(G) R22.2
NetD17_C: D17.C R22.1 U6.5(LO)
NetD20_A: D20.A Q3.1(G) R23.2
NetD20_C: D20.C R23.1 U7.7(HO)
NetD22_A: D22.A Q4.1(G) R24.2
NetD22_C: D22.C R24.1 U7.5(LO)
NetD23_A: D23.A Q4.3(S)

### Notes on the sheet
- 4. H BRIDGE
- H-BRIDGE

### Library data of the parts
C32 C35 = C_ALU_330uF_50V_G: as C2 on sheet VOLTAGE_SOURCE; Packaging: Cut Tape (CT); Link: https://jlcpcb.com/partdetail/KNSCHA-RVT330UF50V167RV085/C5155333; Price: $0.0941
C33 C36 = C_ALU_100nF_50V_B: 100nF 50V ±20% SMD,D4xL5.4mm Aluminum Electrolytic Capacitors - SMD ROHS; Manufacturer: Changzhou Huawei Elec; Manufacture Part Number: VT1H0R1MB054000CE0; Packaging: Cut Tape; Link: https://www.lcsc.com/product-detail/Aluminum-Electrolytic-Capacitors-SMD_Changzhou-Huawei-Elec-VT1H0R1MB054000CE0_C271438.html; Price: $ 0.0342
C34 C37 = C_ALU_1uF_50V_B: 1uF 50V 7mA@120Hz ±20% SMD,D4xL5.4mm Aluminum Electrolytic Capacitors - SMD ROHS; Manufacturer: KNSCHA; Manufacture Part Number: RST1UF50V017; Packaging: Cut Tape; Link: https://www.lcsc.com/product-detail/Aluminum-Electrolytic-Capacitors-SMD_KNSCHA-RST1UF50V017_C4747972.html; Price: $ 0.0209
D14 D19 = 1N5819: as D6 on sheet MCU; Packaging: Cut Tape (CT); Link: https://www.digikey.cn/en/products/detail/diodes-incorporated/1N5819HW-7-F/814970; Price: $0.43; Operating Temperature - Junction: -65°C ~ 125°C
D15 D17 D20 D22 = 1N4148W-TP: Diode 100 V 150mA Surface Mount SOD-123; Manufacturer: Micro Commercial Co; Manufacture Part Number: 1N4148W-TP; Packaging: Cut Tape (CT); Link: https://www.digikey.cn/en/products/detail/micro-commercial-co/1N4148W-TP/717196; Price: $0.12
D16 D18 D21 D23 = SS54: as D3 on sheet VOLTAGE_SOURCE; Manufacture Part Number: SS54; Packaging: Cut Tape (CT); Link: https://www.digikey.cn/en/products/detail/evvo/SS54/21407219; Price: $0.73
JP5 = TERMINAL_5.08MM_2P: as JP1 on sheet VOLTAGE_SOURCE; Packaging: Bulk; Link: https://www.digikey.cn/en/products/detail/phoenix-contact/1759017/260463?s=N4IgTCBcDaIIwHYCsBOADIkBdAvkA; Price: $0.58
Q1-Q4 = IRF3205STRLPBF: N-Channel 55 V 110A (Tc) 200W (Tc) Surface Mount D2PAK; Manufacturer: Infineon Technologies; Drain to Source Voltage (Vdss): 55 V; Drive Voltage (Max Rds On, Min Rds On): 10V; Vgs (Max): ±20V; Manufacture Part Number: IRF3205STRLPBF; Packaging: Cut Tape (CT); Link: https://www.digikey.cn/en/products/detail/infineon-technologies/IRF3205STRLPBF/856540; Price: $1.73; FET Type: N-Channel; Current - Continuous Drain (Id) @ 25°C: 110A (Tc); Power Dissipation (Max): 200W (Tc); Operating Temperature: -55°C ~ 175°C (TJ)
R21-R24 = R0805_10R: 10 Ohms ±1% 0.125W, 1/8W Chip Resistor 0805 (2012 Metric) Moisture Resistant Thick Film; Manufacturer: YAGEO; Manufacture Part Number: RC0805FR-0710RL; Packaging: Cut Tape (CT); Link: https://www.digikey.com/en/products/detail/yageo/RC0805FR-0710RL/727534; Price: $0.10
U6 U7 = IR2104STRPBF: Half Bridge 2 210mA 100ns 50ns 10V~20V 360mA SOIC-8 Gate Drivers ROHS; Manufacturer: Infineon Technologies; Manufacture Part Number: IR2104STRPBF; Packaging: Cut Tape (CT); Link: https://www.lcsc.com/product-detail/Gate-Drivers_Infineon-Technologies-IR2104STRPBF_C2960.html; Price: $ 0.51; Peak Output Current(source): 210mA; Rise Time: 100ns; Fall Time: 50ns; Supply Voltage: 10V~20V; Peak Output Current(sink): 360mA

## Nets that join several sheets
3.3V: VOLTAGE_SOURCE (7 pins), MCU (6 pins), SENSOR (5 pins)
12V: VOLTAGE_SOURCE (10 pins), H_BRIDGE (6 pins)
24V: VOLTAGE_SOURCE (C1.1 JP1.2 R2.2 U1.1), H_BRIDGE (6 pins)
GND: VOLTAGE_SOURCE (27 pins), MCU (27 pins), SENSOR (9 pins), H_BRIDGE (8 pins)
VBUS: VOLTAGE_SOURCE (C6.1 C7.2 U3.3), MCU (10 pins)
EN: MCU (U4.12), H_BRIDGE (U6.3 U7.3)
MPU_A0: MCU (U4.19), SENSOR (JP4.3 U5.9)
MPU_AUX_DA: MCU (U4.15), SENSOR (JP4.1 U5.6)
MPU_AUXCL: MCU (U4.16), SENSOR (JP4.2 U5.7)
MPU_INT: MCU (U4.20), SENSOR (JP4.4 U5.12)
MPU_SCL: MCU (R19.1 U4.17), SENSOR (JP4.6 U5.23)
MPU_SDA: MCU (R20.1 U4.18), SENSOR (JP4.5 U5.24)
PWM1: MCU (U4.10), H_BRIDGE (U6.2)
PWM2: MCU (U4.11), H_BRIDGE (U7.2)